# EAGLE design cutdown (EAGLE 9.0.0)
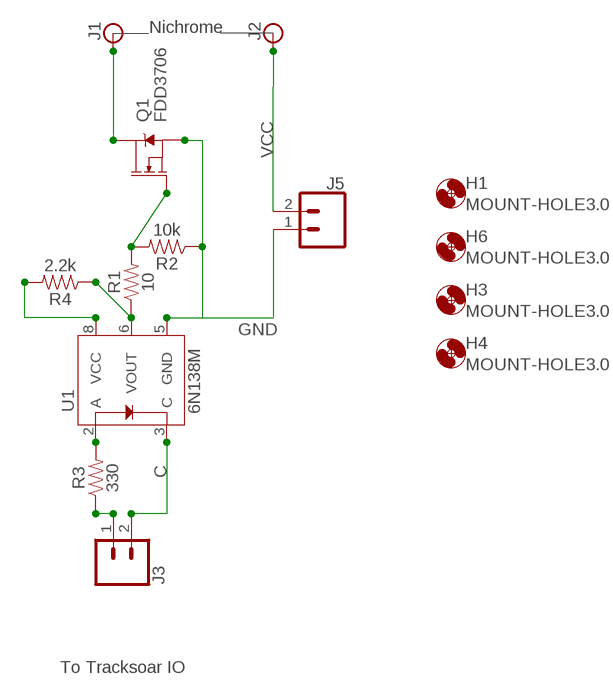
[diagram p0: schematic, sheet 1]

## Parts
H1  MOUNT-HOLE3.0  [3,0]
H3  MOUNT-HOLE3.0  [3,0]
H4  MOUNT-HOLE3.0  [3,0]
H6  MOUNT-HOLE3.0  [3,0]
J1  BANANA_CONN  [BANANA_CONN]
J2  BANANA_CONN  [BANANA_CONN]
J3  CONN_02PTH3  [1X02_LONGPADS]
J5  CONN_02PTH3  [1X02_LONGPADS]
Q1  FDD3706  MOSFET-NCH-FDD8780  [DPAK]
R1  10  10OHM-0603-1/10W-1%  [0603]
R2  10k  10KOHM-0603-1/10W-1%  [0603]
R3  330  10OHM-0603-1/10W-1%  [0603]
R4  2.2k  10OHM-0603-1/10W-1%  [0603]
U1  6N138M  OPTO_DARL_6N138S  [8-SMD]

## Nets
A: J3.1 R3.1
C: J3.2 U1.3(C)
GND: J5.1 Q1.3(S) R2.1 U1.5(GND)
N$2: J1.P$1 Q1.4(D)
N$3: Q1.1(G) R1.2 R2.2
N$4: R1.1 R4.1 U1.6(VOUT)
N$5: R3.2 U1.2(A)
N$6: R4.2 U1.8(VCC)
VCC: J2.P$1 J5.2

## Notes on the sheet
- Nichrome
- To Tracksoar IO

## Library data of the parts
H1 H3 H4 H6 = holes:MOUNT-HOLE: MOUNTING HOLE with drill center marker
J1 J2 = SparkFun-Connectors:BANANA_CONN: Through-hole Banana Jack Basic PTH connection for banana jack plugs SparkFun Products: Multimeter Kit <https://www.sparkfun.com/products/retired/10956> Banana to Alligator Cable <https://www.sparkfun.com/products/retired/509> Banana to Alligator Coax Cable <https://www.sparkfun.com/products/retired/508> Banana to Banana Cable <https://www.sparkfun.com/products/retired/507> Banana to IC Hook Cables <https://www.sparkfun.com/products/retired/506>
J3 J5 = SparkFun-Connectors:CONN_02: Multi connection point. Often used as Generic Header-pin footprint for 0.1 inch spaced/style header connections On any of the 0.1 inch spaced packages, you can populate with these: Break Away Headers - Straight <https://www.sparkfun.com/products/116> (PRT-00116) Break Away Male Headers - Right Angle <https://www.sparkfun.com/products/553> (PRT-00553) Female Headers <https://www.sparkfun.com/products/115> (PRT-00115) Break Away Headers - Machine Pin <https://www.sparkfun.com/products/117> (PRT-00117) Break Away Female Headers - Swiss Machine Pin <https://www.sparkfun.com/products/743> (PRT-00743) For SCREWTERMINALS and SPRING TERMINALS visit here: Screw Terimnals on SparkFun.com <https://www.sparkfun.com/search/results?term=Screw+Terminals> (5mm/3.5mm/2.54mm spacing) This device is also useful as a general connection point to wire up your design to another part of your project. Our various solder wires solder well into these plated through hole pads. Hook-Up Wire - Assortment (Stranded, 22 AWG) <https://www.sparkfun.com/products/11375> (PRT-11375) Hook-Up Wire - Assortment (Solid Core, 22 AWG) <https://www.sparkfun.com/products/11367> (PRT-11367) View the entire wire category on our website here <https://www.sparkfun.com/categories/141> Special notes: Molex polarized connector foot print use with: PRT-08233 with associated crimp pins and housings. 2.54_SCREWTERM for use with PRT-10571. 3.5mm Screw Terminal footprints for PRT-08084 5mm Screw Terminal footprints for use with PRT-08432
Q1 = SparkFun-DiscreteSemi:MOSFET-NCH: N-channel MOSFETs Voltage controlled devices that allow control of high current outputs. SparkFun Products: SparkFun OpenScale <https://www.sparkfun.com/products/13261> SparkFun Digital Sandbox <https://www.sparkfun.com/products/12651> SparkFun Monster Moto Shield <https://www.sparkfun.com/products/10182> SparkFun MOSFET Power Controller <https://www.sparkfun.com/products/11214>; PROD_ID: TRANS-09984; VALUE: 35A/25V/8.5mΩ
R1 = SparkFun-Resistors:10OHM: 10Ω resistor A resistor is a passive two-terminal electrical component that implements electrical resistance as a circuit element. Resistors act to reduce current flow, and, at the same time, act to lower voltage levels within circuits. - Wikipedia; PROD_ID: RES-12581
R2 = SparkFun-Resistors:10KOHM: 10kΩ resistor A resistor is a passive two-terminal electrical component that implements electrical resistance as a circuit element. Resistors act to reduce current flow, and, at the same time, act to lower voltage levels within circuits. - Wikipedia; PROD_ID: RES-00824
R3 R4 = SparkFun-Resistors:10OHM: 10Ω resistor A resistor is a passive two-terminal electrical component that implements electrical resistance as a circuit element. Resistors act to reduce current flow, and, at the same time, act to lower voltage levels within circuits. - Wikipedia; PROD_ID: RES-12581; VALUE: 10
U1 = SparkFun-DiscreteSemi:OPTO_DARL_6N138S: Optoisolator, darlington pair output Optocoupler consisting of an AlGaAs LED optically coupled to a high gain split darlington photodetector. SparkFun Products: SparkFun MIDI Shield <https://www.sparkfun.com/products/12898>; PROD_ID: IC-09482

## Board
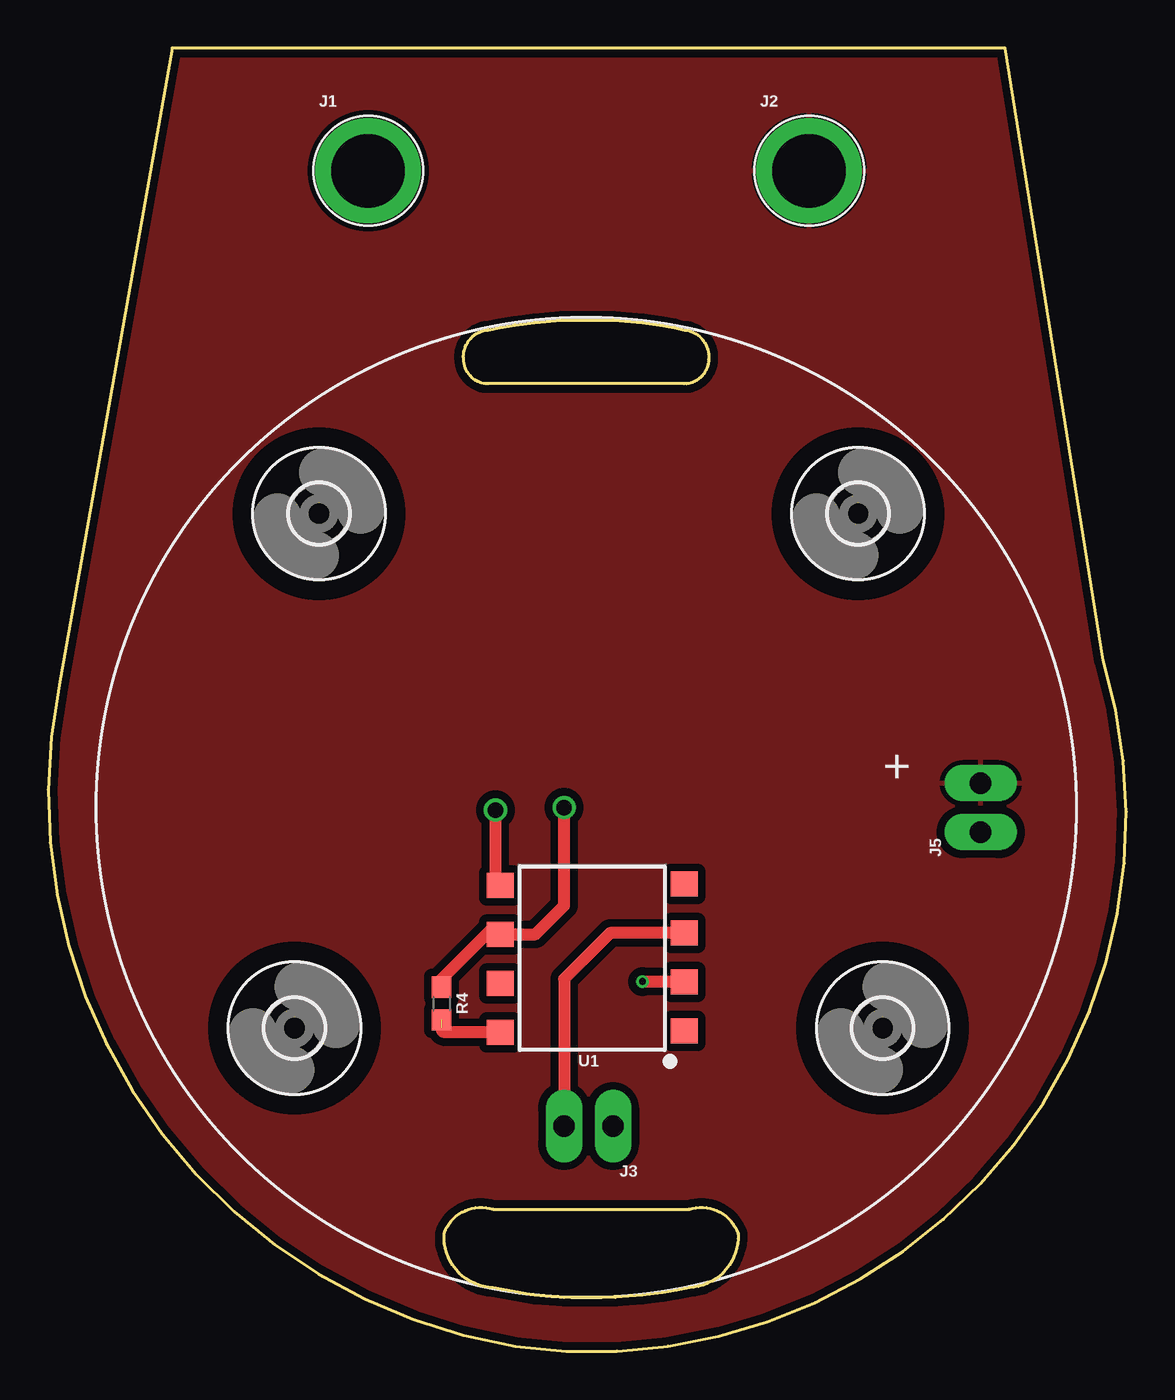
[diagram p1: board, top side]
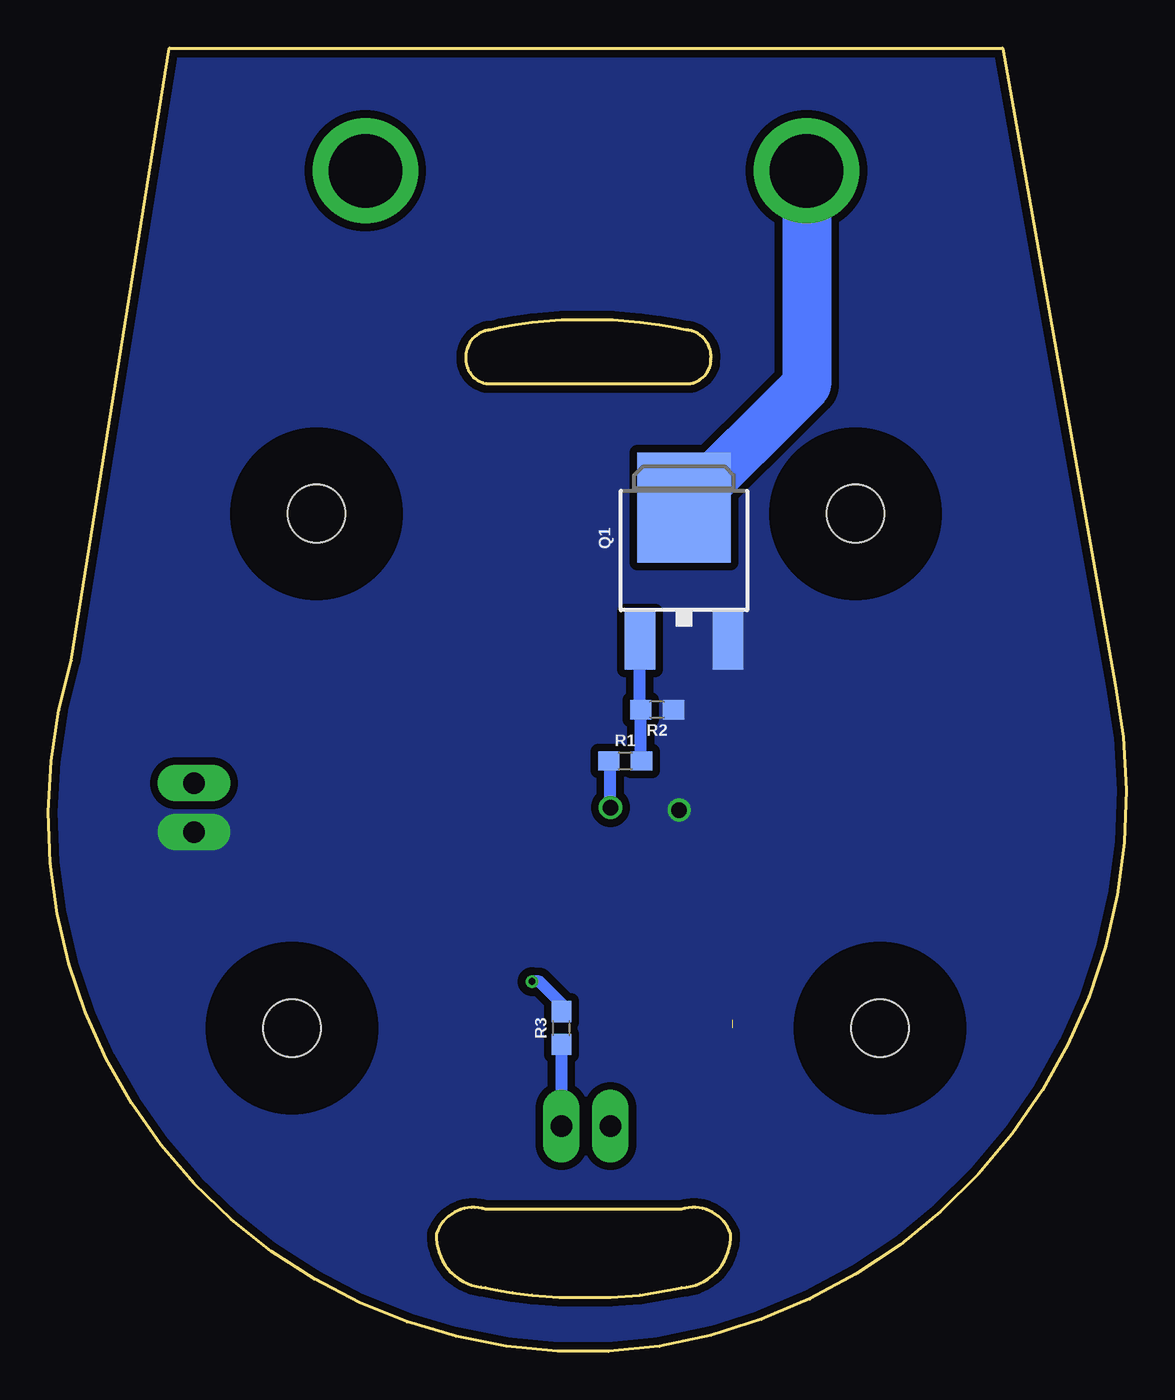
[diagram p2: board, bottom side, seen from below]

Size 55.87 x 67.56 mm. Coordinates in mm from the lower left corner, seen from the top.
Outline: 6.41,67.56 0.57,34.54 arc92 24.19,0.25 arc115 54.67,35.81 49.59,67.56 6.41,67.56
Copper layers (1*16): Top 0.035mm / dielectric 1.5mm / Bottom 0.035mm
Design rules "MF_Standard_2_Layer": minimum track width 5mil, minimum drill 12mil, track to track 5mil, track to pad 5mil, pad to pad 5mil, via to via 5mil, smd to smd 0mil, copper to edge 10mil, drill to drill 10mil, minimum pad ring 6mil, minimum via ring 6mil, stop-mask expansion 2mil, vias tented up to drill 25mil, thermal gap 10mil

### Footprints (pad centres in the part's own frame; a part is rotated, then mirrored left to right if it is on the bottom)
3,0 = hole 3: 0,0
BANANA_CONN = drill 3.81 pad 5.461: P$1 0,0
1X02_LONGPADS = drill 1.118 pad 1.88 long: 1 0,0; 2 2.54,0
DPAK = smd 1.6 x 3: 1 -2.28,-5.31; 3 2.28,-5.31 | smd 4.826 x 5.715: 4 0,1.588
0603 = smd 1.1 x 1: 1 -0.85,0; 2 0.85,0
8-SMD = smd 1.3 x 1.4: 1 -3.96,-4.96; 2 -1.42,-4.96; 3 1.12,-4.96; 4 3.66,-4.96; 5 3.59,4.58; 6 1.05,4.58; 7 -1.49,4.58; 8 -4.03,4.58

### Placement (x,y rotation side)
H1  14.03,43.43 0 top
H3  12.76,16.76 0 top
H4  43.24,16.76 0 top
H6  41.97,43.43 0 top
J1  16.57,61.21 0 top
J2  39.43,61.21 0 top
J3  29.27,11.68 180 top
J5  48.32,26.92 90 top
Q1  22.92,42.16 0 bottom
R1  25.97,30.6 0 bottom
R2  24.32,33.27 180 bottom
R3  29.27,16.76 90 bottom
R4  20.38,18.03 270 top
U1  28,20.57 90 top

### Tracks (layer width: path | path; a pad name or v marks a point on that pad's centre or on a via)
A
  Bottom 0.61: R3.1 J3.1
C
  Top 0.61: U1.3 29.12,21.69 26.73,19.3 J3.2
GND  (via drill 0.8)
  Top 0.61: 23.2,24.38 U1.5 23.18,24.4 v23.18,28.06
  pour Bottom (isolate 0.406, no thermals): -1.21,68.83 58.48,68.83 58.48,-1.02 -1.21,-1.02
N$2
  Bottom 2.54: J1.P$1 16.57,50.1 Q1.4
N$3
  Bottom 0.61: R1.2 25.17,30.65 R2.2 25.2,33.3 Q1.1
N$4  (via drill 0.8 pad 0.8)
  Top 0.61: v26.73,28.19 26.73,23.11 25.24,21.62 24.19,21.62 U1.6 23.14,21.62 22.92,21.84 20.38,19.3 R4.1
  Bottom 0.61: v26.73,28.19 26.73,30.69 | 26.73,30.73 26.73,30.69 | 26.73,30.69 R1.1
N$5  (via drill 0.35)
  Top 0.61: v30.8,19.17 32.94,19.17 U1.2
  Bottom 0.61: R3.2 29.27,18.03 30.42,19.17 v30.8,19.17
N$6  (1 unrouted)
  Top 0.61: U1.8 20.6,16.54 arc-90 20.38,16.76
VCC
  pour Top (isolate 0.406): -5.02,70.1 58.48,70.1 58.48,-1.02 -1.21,-1.02

### Text on the board
tNames: +